# EAGLE design motor control board (EAGLE 9.6.2)
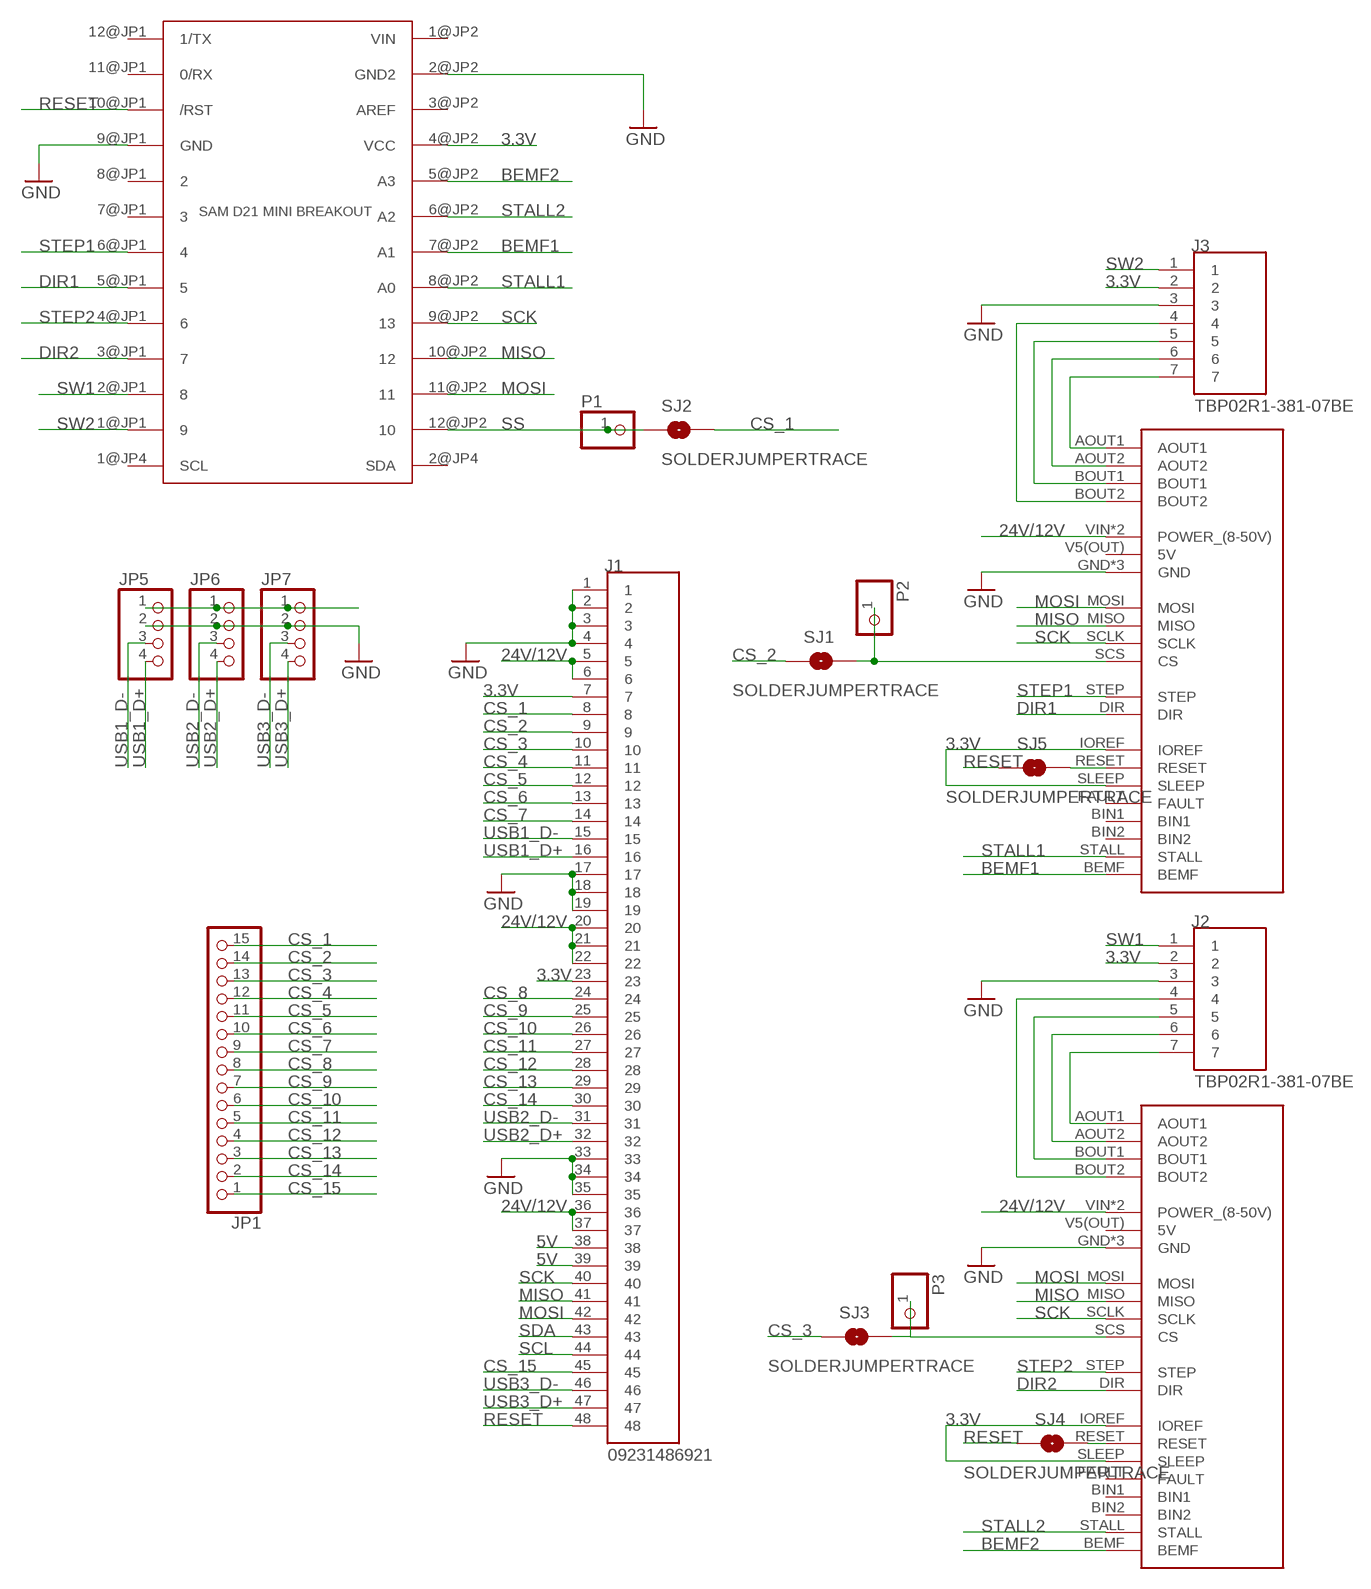
[diagram p0: schematic, sheet 1]

## Parts
J1  09231486921  [HARTING_09231486921]
J2  TBP02R1-381-07BE  [CUI_TBP02R1-381-07BE]
J3  TBP02R1-381-07BE  [CUI_TBP02R1-381-07BE]
JP1  PINHD-1X15  [1X15]
JP5  PINHD-1X4  [1X04]
JP6  PINHD-1X4  [1X04]
JP7  PINHD-1X4  [1X04]
P1  PINHD-1X1  [1X01]
P2  PINHD-1X1  [1X01]
P3  PINHD-1X1  [1X01]
SJ1  SOLDERJUMPERTRACE  [SJ_2S-TRACE]
SJ2  SOLDERJUMPERTRACE  [SJ_2S-TRACE]
SJ3  SOLDERJUMPERTRACE  [SJ_2S-TRACE]
SJ4  SOLDERJUMPERTRACE  [SJ_2S-TRACE]
SJ5  SOLDERJUMPERTRACE  [SJ_2S-TRACE]
U$1  POLOLU_HIGH-POWER_STEPPER_MOTOR_DRIVER_36V4  [BREAKOUT_BOARD]
U$2  POLOLU_HIGH-POWER_STEPPER_MOTOR_DRIVER_36V4  [BREAKOUT_BOARD]
U$4  SAM_D21_MINI_BREAKOUT  [JP1_SPARKFUN-SAMD21-MINI-BREAKOUT-V10]

## Nets
3.3V: J1.7 J1.23 J2.2 J3.2 U$1.IOREF U$1.SLEEP U$2.IOREF U$2.SLEEP U$4.4@JP2(VCC)
5V: J1.38 J1.39 JP5.1 JP6.1 JP7.1
24V/12V: J1.5 J1.6 J1.20 J1.21 J1.22 J1.36 J1.37 U$1.VIN(POWER_(8-50V)) U$1.VIN_2(POWER_(8-50V)) U$2.VIN(POWER_(8-50V)) U$2.VIN_2(POWER_(8-50V))
BEMF1: U$1.BEMF U$4.7@JP2(A1)
BEMF2: U$2.BEMF U$4.5@JP2(A3)
CS_1: J1.8 JP1.15 SJ2.2
CS_2: J1.9 JP1.14 SJ1.1
CS_3: J1.10 JP1.13 SJ3.1
CS_4: J1.11 JP1.12
CS_5: J1.12 JP1.11
CS_6: J1.13 JP1.10
CS_7: J1.14 JP1.9
CS_8: J1.24 JP1.8
CS_9: J1.25 JP1.7
CS_10: J1.26 JP1.6
CS_11: J1.27 JP1.5
CS_12: J1.28 JP1.4
CS_13: J1.29 JP1.3
CS_14: J1.30 JP1.2
CS_15: J1.45 JP1.1
DIR1: U$1.DIR U$4.5@JP1
DIR2: U$2.DIR U$4.3@JP1
GND: J1.1 J1.2 J1.3 J1.4 J1.17 J1.18 J1.19 J1.33 J1.34 J1.35 J2.3 J3.3 JP5.2 JP6.2 JP7.2 U$1.GND U$1.GND_2(GND) U$1.GND_3(GND) U$2.GND U$2.GND_2(GND) U$2.GND_3(GND) U$4.9@JP1(GND)
MISO: J1.41 U$1.MISO U$2.MISO U$4.10@JP2
MOSI: J1.42 U$1.MOSI U$2.MOSI U$4.11@JP2
N$1: J3.7 U$1.AOUT1
N$2: J3.6 U$1.AOUT2
N$3: J3.5 U$1.BOUT1
N$4: J3.4 U$1.BOUT2
N$5: SJ4.2 U$2.RESET
N$6: J2.7 U$2.AOUT1
N$7: J2.6 U$2.AOUT2
N$8: J2.5 U$2.BOUT1
N$9: J2.4 U$2.BOUT2
N$10: P2.1 SJ1.2 U$1.SCS(CS)
N$11: SJ5.2 U$1.RESET
N$12: P3.1 SJ3.2 U$2.SCS(CS)
N$13 [GND]: U$4.2@JP2(GND2) ; supply symbol labelled GND
RESET: J1.48 SJ4.1 SJ5.1 U$4.10@JP1(/RST)
SCK: J1.40 U$1.SCLK U$2.SCLK U$4.9@JP2
SCL: J1.44
SDA: J1.43
SS: P1.1 SJ2.1 U$4.12@JP2
STALL1: U$1.STALL U$4.8@JP2(A0)
STALL2: U$2.STALL U$4.6@JP2(A2)
STEP1: U$1.STEP U$4.6@JP1
STEP2: U$2.STEP U$4.4@JP1
SW1: J2.1 U$4.2@JP1
SW2: J3.1 U$4.1@JP1
USB1_D+: J1.16 JP5.4
USB1_D-: J1.15 JP5.3
USB2_D+: J1.32 JP6.4
USB2_D-: J1.31 JP6.3
USB3_D+: J1.47 JP7.4
USB3_D-: J1.46 JP7.3
Unconnected: U$1.BIN1 U$1.BIN2 U$1.FAULT U$1.V5(OUT)(5V) U$2.BIN1 U$2.BIN2 U$2.FAULT U$2.V5(OUT)(5V) U$4.1@JP4(SCL) U$4.2@JP4(SDA) U$4.7@JP1 U$4.8@JP1 U$4.11@JP1(0/RX) U$4.12@JP1(1/TX)

## Power pins joined to a net without a drawn wire
AREF: U$4.3@JP2(AREF)
VIN: U$4.1@JP2(VIN)

## Library data of the parts
J1 = din41612_48_pin_board:09231486921: Check prices <https://pricing.snapeda.com/parts/8-1393644-0/TE%20Connectivity/view-part?ref=eda>; MANUFACTURER-PART-NUMBER: 09231486921; PACKAGE: None
J2 J3 = TBP02R1-381-07BE:TBP02R1-381-07BE: Check prices <https://pricing.snapeda.com/parts/TBP02R1-381-07BE/CUI%20Devices/view-part?ref=eda>; AVAILABILITY: In Stock; CUI_PURCHASE_URL: https://www.cuidevices.com/product/interconnect/connectors/terminal-blocks/tbp02r1-381-series?utm_source=snapeda.com&utm_medium=referral&utm_campaign=snapedaBOM; DESCRIPTION: 2~24 Poles, Pluggable,Receptacle, Horizontal, 3.81 Pitch, Terminal Block Connector; MF: CUI Devices; MP: TBP02R1-381-07BE; PACKAGE: None; PRICE: None; PURCHASE-URL: https://pricing.snapeda.com/search/part/TBP02R1-381-07BE/?ref=eda
JP1 = pinhead:PINHD-1X15: PIN HEADER
JP5-JP7 = pinhead:PINHD-1X4: PIN HEADER
P1-P3 = pinhead:PINHD-1X1: PIN HEADER
SJ1-SJ5 = SparkFun-Passives:SOLDERJUMPER: Solder Jumper Standard SMD solder jumper. Used to automate production. Two varients : Normally Open and Normally Closed are the same, but have different paste layers. NC will have a large amount of paste and should jumper during reflow.
U$1 U$2 = high_power_stepper_driver_36V4:POLOLU_HIGH-POWER_STEPPER_MOTOR_DRIVER_36V4; PURCHASE_URL_POLOLU: https://www.pololu.com/product/3730/resources
U$4 = SparkFun-SAMD21-Mini-Breakout:SAM_D21_MINI_BREAKOUT: SPARKFUN-SAMD21-MINI-BREAKOUT; MANUFACTURER-PART-NUMBE: SparkFun SAMD21 mini breakout, SLW-112-01-G-S < buy two of these; PACKAGE: None; SIMILAR-COMPONENTS: None, https://www.adafruit.com/product/3008

## Net classes
1 POWER: clearance 0.508 mm
2 GND: width 0.305 mm, clearance 0.305 mm to class 0, clearance 0.305 mm to class 1

## Board
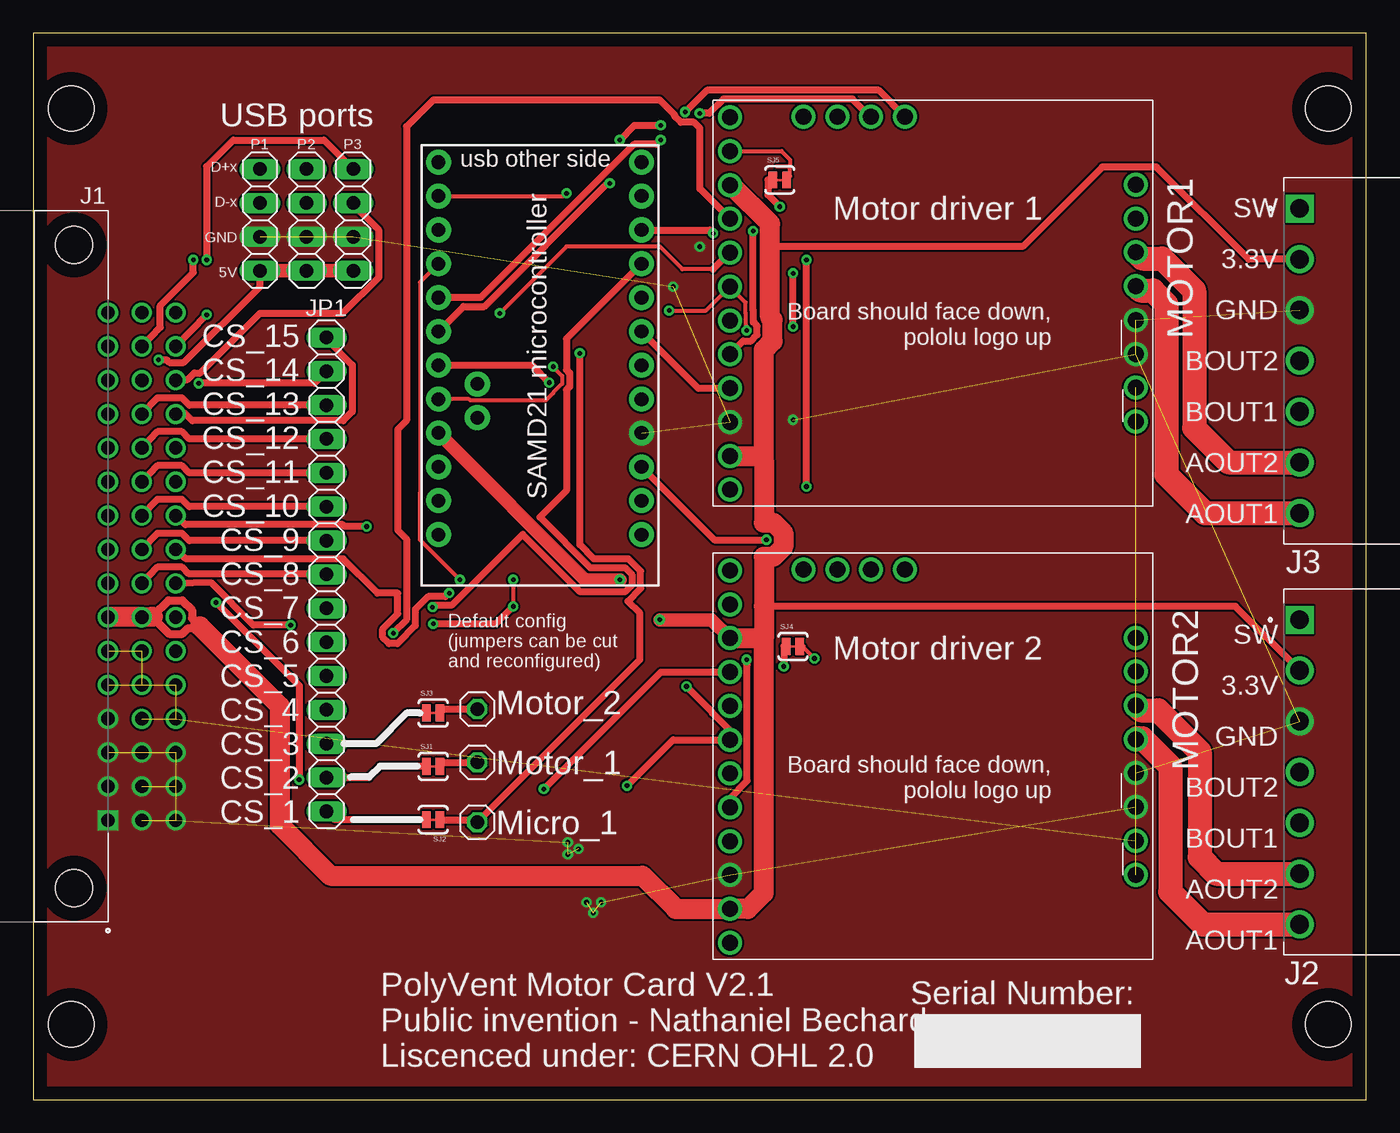
[diagram p1: board, top side]
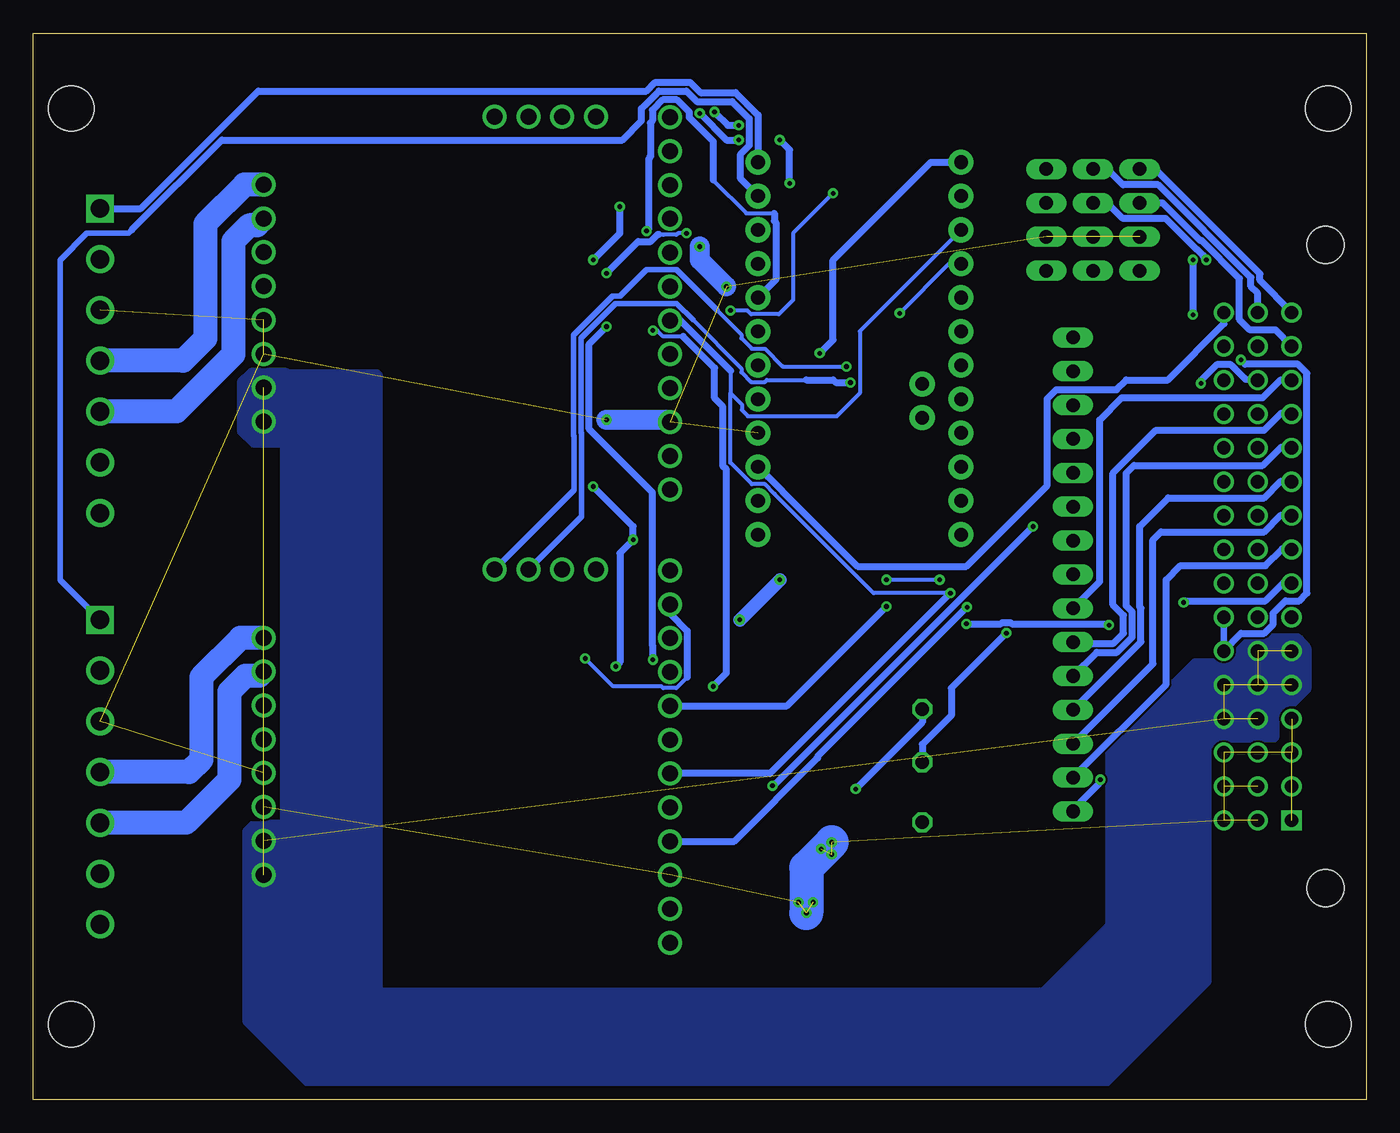
[diagram p2: board, bottom side, seen from below]

Size 100 x 80 mm. Coordinates in mm from the lower left corner, seen from the top.
Outline: 0,0 100,0 100,80 0,80 0,0
Copper layers (1*16): Top 0.035mm / dielectric 1.5mm / Bottom 0.035mm
Design rules "default": minimum track width 6mil, minimum drill 0.35mm, track to track 6mil, track to pad 6mil, pad to pad 6mil, via to via 6mil, smd to smd 6mil, copper to edge 40mil, drill to drill 6mil, minimum pad ring 10mil, minimum via ring 8mil, stop-mask expansion 4mil, vias tented up to drill 0mil, thermal gap 10mil
Holes 3.4 mm at 2.84,5.64 2.84,74.36 97.16,74.36 97.16,5.64

### Footprints (pad centres in the part's own frame; a part is rotated, then mirrored left to right if it is on the bottom)
HARTING_09231486921 = drill 1 pad 1.35 square: 1 0,0 | drill 1 pad 1.35: 2 -2.54,0; 3 -5.08,0; 4 -7.62,0; 5 -10.16,0; 6 -12.7,0; 7 -15.24,0; 8 -17.78,0; 9 -20.32,0; 10 -22.86,0; 11 -25.4,0; 12 -27.94,0; 13 -30.48,0; 14 -33.02,0; 15 -35.56,0; 16 -38.1,0; 17 0,2.54; 18 -2.54,2.54; 19 -5.08,2.54; 20 -7.62,2.54; 21 -10.16,2.54; 22 -12.7,2.54; 23 -15.24,2.54; 24 -17.78,2.54; 25 -20.32,2.54; 26 -22.86,2.54; 27 -25.4,2.54; 28 -27.94,2.54; 29 -30.48,2.54; 30 -33.02,2.54; 31 -35.56,2.54; 32 -38.1,2.54; 33 0,5.08; 34 -2.54,5.08; 35 -5.08,5.08; 36 -7.62,5.08; 37 -10.16,5.08; 38 -12.7,5.08; 39 -15.24,5.08; 40 -17.78,5.08; 41 -20.32,5.08; 42 -22.86,5.08; 43 -25.4,5.08; 44 -27.94,5.08; 45 -30.48,5.08; 46 -33.02,5.08; 47 -35.56,5.08; 48 -38.1,5.08 | hole 2.8: -43.18,-2.54; 5.08,-2.54
CUI_TBP02R1-381-07BE = drill 1.4 square: 1 0,0 | drill 1.4: 2 3.81,0; 3 7.62,0; 4 11.43,0; 5 15.24,0; 6 19.05,0; 7 22.86,0
1X15 = drill 1.016 long: 1 -17.78,0; 2 -15.24,0; 3 -12.7,0; 4 -10.16,0; 5 -7.62,0; 6 -5.08,0; 7 -2.54,0; 8 0,0; 9 2.54,0; 10 5.08,0; 11 7.62,0; 12 10.16,0; 13 12.7,0; 14 15.24,0; 15 17.78,0
1X04 = drill 1.016 long: 1 -3.81,0; 2 -1.27,0; 3 1.27,0; 4 3.81,0
1X01 = drill 1.016 octagon: 1 0,0
SJ_2S-TRACE = smd 0.635 x 1.27: 1 -0.508,0; 2 0.508,0
BREAKOUT_BOARD = drill 1.2: AOUT1 1.27,13.97; AOUT2 1.27,11.43; BEMF 18.6,1.24; BIN1 26.22,1.24; BIN2 23.68,1.24; BOUT1 1.27,8.89; BOUT2 1.27,6.35; DIR 31.75,19.08; FAULT 31.75,1.3; GND 31.75,24.16; GND_2 1.27,19.05; GND_3 1.27,16.51; IOREF 31.75,26.7; MISO 31.75,16.54; MOSI 31.75,14; RESET 31.75,3.84; SCLK 31.75,11.46; SCS 31.75,8.92; SLEEP 31.75,6.38; STALL 21.14,1.24; STEP 31.75,21.62; V5(OUT) 31.75,29.24; VIN 1.27,24.13; VIN_2 1.27,21.59
JP1_SPARKFUN-SAMD21-MINI-BREAKOUT-V10 = drill 1.016 pad 1.88: 1@JP1 1.27,1.27; 1@JP2 16.51,29.21; 1@JP4 13.589,17.907; 2@JP1 1.27,3.81; 2@JP2 16.51,26.67; 2@JP4 13.589,20.447; 3@JP1 1.27,6.35; 3@JP2 16.51,24.13; 4@JP1 1.27,8.89; 4@JP2 16.51,21.59; 5@JP1 1.27,11.43; 5@JP2 16.51,19.05; 6@JP1 1.27,13.97; 6@JP2 16.51,16.51; 7@JP1 1.27,16.51; 7@JP2 16.51,13.97; 8@JP1 1.27,19.05; 8@JP2 16.51,11.43; 9@JP1 1.27,21.59; 9@JP2 16.51,8.89; 10@JP1 1.27,24.13; 10@JP2 16.51,6.35; 11@JP1 1.27,26.67; 11@JP2 16.51,3.81; 12@JP1 1.27,29.21; 12@JP2 16.51,1.27

### Placement (x,y rotation side)
J1  5.6,20.95 270 top
J2  95,36 270 top
J3  95,66.86 270 top
JP1  22,39.4 270 top
JP5  17,66 90 top
JP6  20.5,66 90 top
JP7  24,66 90 top
P1  33.3,20.8 0 top
P2  33.3,25.3 0 top
P3  33.3,29.3 0 top
SJ1  30,25 0 top
SJ2  30,21 180 top
SJ3  30,29 0 top
SJ4  57,34 0 top
SJ5  56,69 0 top
U$1  84,75 180 top
U$2  84,41 180 top
U$4  46.9,71.6 180 top

### Tracks (layer width: path | path; a pad name or v marks a point on that pad's centre or on a via)
3.3V  (via drill 0.35)
  Top 0.508: J2.2 90.19,37 54.8,37 | 54.8,64 55.28,64 74.23,64 80.19,69.96 84.27,69.96 91.18,63.05 J3.2
  Top 0.6: 8.88,36.23 10.18,34.93 11.18,34.93 11.57,35.33 12.33,35.33 12.5,35.5 11.9,36.1 11.9,36.73 11.18,37.45 10.15,37.45 8.97,36.27 8.97,36.24
  Top 1.016: 52.36,68.62 U$1.SLEEP | U$4.4@JP2 41.4,39 v44,39 | v47,36 50.87,36 U$2.SLEEP
  Top 1.5: U$1.IOREF 54.5,48.3 54.8,48 | 54.8,34.6 54.8,37 54.8,40.72 55.53,40.72 56.28,41.47 56.28,42.53 55.53,43.28 54.8,43.28 54.8,48 | 54.8,34.6 54.8,15.5 53.6,14.3 U$2.IOREF 48.2,14.3 45.7,16.8 22.3,16.8 18.5,20.6 18.5,29.5 12.5,35.5 | U$2.SLEEP 54.78,34.62 54.8,34.6 | 54.8,48 54.8,56.24 55.46,56.9 55.46,58.51 55.28,58.69 55.28,64 55.28,65.7 52.36,68.62 | J1.7 J1.23 8.88,36.23 8.97,36.24
  Bottom 1.016: v44,39 v47,36
5V  (via drill 0.35)
  Top 0.508: v9.4,55.5 10,55.5 10.2,55.3 11.3,55.3 17,61 JP5.1
  Top 1.016: JP7.1 JP6.1 JP5.1
  Bottom 0.5: J1.39 J1.38
  Bottom 0.508: J1.38 9.4,34.98 7.66,34.98 6.98,35.66 6.98,36.5 6.06,37.42 5.02,37.42 4.44,38 4.44,54.5 5.12,55.18 9.08,55.18 v9.4,55.5
24V/12V  (10 unrouted)
  pour Bottom (no thermals): 4.6,33.8 4.6,30.9 7,28.5 7,27.3 11.3,27.3 12.1,26.5 12.1,8.9 19.9,1.1 79,1.1 83.8,5.9 83.8,20.1 83.4,20.5 81,20.5 81,49.4 83.4,49.4 84.2,50.2 84.2,53.8 83.6,54.4 81.1,54.4 81,54.3 74.3,54.3 74.3,8.2 74,7.9 24.2,7.9 19.1,13 19.1,26.3 12.8,32.6 10.4,32.6 8.5,34.5 5.2,34.5
BEMF1  (via drill 0.35)
  Top 0.508: U$1.BEMF 63.43,75.73 50.53,75.73 v48.9,74.1 | U$4.7@JP2 32.27,59.51 33.84,59.51 43.08,68.75 v43.25,68.75 | v44,72 45.1,73.1 v47.08,73.1
  Bottom 0.508: v48.9,74.1 47.9,73.1 v47.08,73.1 | v43.25,68.75 43.25,71.25 v44,72
BEMF2  (via drill 0.35)
  Top 0.305: v39,55 39,54.97 39.68,54.28 39.68,53.72 39,53.03 39,53 38.45,52.45 32.8,52.45 32.69,52.55 U$4.5@JP2
  Bottom 0.305: 48.74,59.26 46.88,57.4 46.88,57.11 46.09,56.34 45.11,56.34 43.78,55 v39,55
  Bottom 0.406: 48.72,59.25 48.74,59.26 51.73,62.26 54,62.26 55.98,60.27 56.55,60.27 59.47,57.36 59.47,49.82 59.42,49.77 59.42,45.74 U$2.BEMF
CS_1  (via drill 0.35)
  Top 0.508: JP1.15 22.62,21 SJ2.2 | v13.7,37.3 19.95,31.05 v19.95,24
  Bottom 0.508: J1.8 6.21,38.76 7.56,37.42 13.58,37.42 v13.7,37.3 | v19.95,24 20.07,23.88 20.07,23.68 22,21.75 JP1.15
CS_2
  Top 0.508: JP1.14 25.16,24.16 26,25 SJ1.1
  Bottom 0.508: JP1.14 15,31.16 15,39 13.94,40.06 7.56,40.06 6.31,41.31 J1.9
CS_3
  Top 0.508: SJ3.1 28,29 25.7,26.7 JP1.13
  Bottom 0.508: JP1.13 16,32.7 16,42 15.4,42.6 7.66,42.6 6.4,43.85 J1.10
CS_4
  Bottom 0.508: J1.11 6.4,46.4 7.66,45.14 14.86,45.14 17,43 17,36.98 16.89,36.87 16.89,34.34 JP1.12
CS_5
  Bottom 0.508: J1.12 6.4,48.94 7.76,47.58 17.42,47.58 18,47 18,37.04 17.55,36.6 17.55,34.7 18.7,33.55 20.23,33.55 JP1.11
CS_6
  Bottom 0.508: J1.13 6.4,51.48 7.66,50.22 15.78,50.22 19,47 19,37.11 18.21,36.33 18.21,34.98 18.96,34.23 21.91,34.23 JP1.10
CS_7
  Bottom 0.508: JP1.9 20,38.86 20,51 18.34,52.66 7.76,52.66 6.4,54.02 J1.14
CS_8
  Top 0.508: J1.24 9.3,39.94 11.16,39.94 11.66,39.44 21.96,39.44 JP1.8
CS_9
  Top 0.508: JP1.7 11.7,41.94 11.16,42.48 9.3,42.48 J1.25
CS_10
  Top 0.508: JP1.6 11.7,44.48 11.16,45.02 9.3,45.02 J1.26
CS_11
  Top 0.508: JP1.5 11.7,47.02 11.16,47.56 9.3,47.56 J1.27
CS_12
  Top 0.508: JP1.4 11.7,49.56 11.16,50.1 9.3,50.1 J1.28
CS_13
  Top 0.508: JP1.3 11.7,52.1 11.16,52.64 9.3,52.64 J1.29
CS_14  (via drill 0.35)
  Top 0.508: v12.4,53.74 21.1,53.74 JP1.2
  Bottom 0.508: J1.30 9.04,54.02 10.2,55.18 11.16,55.18 12.4,53.94 v12.4,53.74
CS_15
  Top 0.508: J1.45 11.39,51.48 11.94,50.93 23.25,50.93 23.93,51.62 23.93,55.12 22,57.05 JP1.1
DIR1  (via drill 0.35)
  Top 0.508: U$1.DIR 53.25,56.92 53.84,56.92 54.3,57.38 54.3,58.03 54.01,58.32 54.01,59.19 54,59.2 v54,65.17
  Bottom 0.305: 49,69 46.5,66.5 44.4,66.5
  Bottom 0.508: 53.97,65.17 v54,65.17 53.83,65.34 53.83,70.59 53.71,70.71 53.71,73.29 53.56,73.44 53.56,74.24 52.79,75.01 51.71,75.01 50.78,74.08 50.78,73.67 49,71.89 49,69 | 44.4,66.5 44.4,65.92 44.28,65.81 44.28,61.52 U$4.5@JP1
DIR2  (via drill 0.35)
  Top 0.508: U$2.DIR 52.25,22.61 53.56,23.92 53.56,32.62 53.52,32.66 v53.52,33 | v57,58 v57,62 | U$4.3@JP1 50.75,65.25 v51,65
  Bottom 0.305: v51,65 51.63,65 51.75,64.88 52.75,64.88 52.77,64.9 53.16,64.9
  Bottom 0.508: v53.52,33 53.52,34.04 53.56,34.08 53.56,45.56 58.3,50.3 58.3,56.7 v57,58 | v57,62 54.61,64.39 53.67,64.39 53.16,64.9 53.09,64.9
GND  (via drill 0.35)  (27 unrouted)
  Bottom 1.5: U$1.GND 52.41,51 v57,51 | v48,61 50,63 v50,64
  Bottom 2.54: v40.1,19.3 42,17.4 v42,14
  other vias: 40.9,18.8 40.1,18.4 41.5,14.8 42.6,14.8
  pour Top (no thermals): 0,0 0,80 100,80 100,0
MISO  (via drill 0.35)
  Top 0.508: J1.41 11.4,40.6 11.43,40.6 11.47,40.57 23.25,40.57 25.81,38 27.34,38 27.34,36.45 26.21,35.33 26.21,34.67 26.68,34.22 27.32,34.22 28.66,35.55 28.66,36.77 29.62,37.73 30.93,37.73 v31.2,38
  Bottom 0.305: 47.7,54.7 47.7,53 | U$4.10@JP2 38,57.64 38,53 39.72,51.28 46.38,51.28 46.85,51.74 46.85,52.15 47.7,53 | v31.2,38 36.95,38 44.38,45.44 44.38,45.45 45.11,46.17 46.09,46.17 47.7,47.78 47.7,53
  Bottom 0.508: 31.41,37.78 v31.2,38 44.74,24.46 U$2.MISO | U$1.MISO 51.46,58.46 47.7,54.7 47.67,54.67
MOSI  (via drill 0.35)
  Top 0.305: v53.52,57.71 53.52,58.03 53.45,58.09 53.45,58.96 53.44,58.97 53.44,59.81 U$1.MOSI 50.45,59.2 v47.7,59.2 | U$4.11@JP2 39.79,67.79 v40,68
  Top 0.508: v25,43 23.35,43 23.21,43.14 11.4,43.14 J1.42 | v44.55,23.55 48,27 U$2.MOSI 52.25,27.69 50.94,29 50.94,29.06 v49,31
  Bottom 0.305: v53.52,57.71 53.2,57.71 52.75,57.26 51.26,57.26 | v40,68 43,65 43,60 44.08,58.92 46.15,58.92 46.42,59.2 v47.7,59.2
  Bottom 0.508: 51.26,57.26 48.88,54.88 48.88,52.62 48.26,51.99 48.26,47.55 48,47.29 48,32 v49,31 | v44.55,23.55 44.45,23.55 v25,43
N$1
  Top 1.8: U$1.AOUT1 83.06,60.7 84,60.7 85,59.7 85,46.9 87.9,44 J3.7
N$2
  Top 1.8: U$1.AOUT2 83.2,63.1 84.7,63.1 87.1,60.7 87.1,50.4 89.69,47.81 J3.6
N$3
  Bottom 1.8: U$1.BOUT1 83.24,65.6 83.8,65.6 85,64.4 85,55.9 89.28,51.62 J3.5
N$4
  Bottom 1.8: U$1.BOUT2 84.15,68.65 87.1,65.7 87.1,57.1 88.77,55.43 J3.4
N$5  (via drill 0.35)
  Top 0.152: SJ4.2 57.7,34 57.79,33.91
  Top 0.305: v58.6,33.1 57.79,33.91 57.79,34
  Bottom 0.305: 50.94,31.68 51.75,30.88 52.75,30.88 52.87,31 56.5,31 v58.6,33.1
  Bottom 0.508: U$2.RESET 52.25,36.47 50.94,35.16 50.94,31.68
N$6
  Top 1.8: U$2.AOUT1 82.8,27.1 83.2,27.1 85.3,25 85.3,15.6 87.76,13.14 J2.7
N$7
  Top 1.8: U$2.AOUT2 83.1,29.2 84.4,29.2 87.5,26.1 87.5,18.2 88.75,16.95 J2.6
N$8
  Bottom 1.8: U$2.BOUT1 83.04,31.8 84.1,31.8 85.3,30.6 85.3,24 88.54,20.76 J2.5
N$9
  Bottom 1.8: U$2.BOUT2 84.45,34.65 87.4,31.7 87.4,25.5 88.33,24.57 J2.4
N$10  (via drill 0.35)
  Top 0.508: SJ1.2 30.81,25.3 P2.1 | U$1.SCS 50,68.33 50,72.89 49.58,73.31 48.58,73.31 48.12,73.78 48.12,73.89 47,75 30,75 28,73 28,50.93 27.34,50.27 27.34,42.73 28,42.07 28,36 v27,35
  Bottom 0.508: v27,35 31.13,30.87 31.13,28.82 33.3,26.65 P2.1
N$11
  Top 0.305: U$1.RESET 56.14,71.16 56.79,70.51 56.79,70 | 56.79,70 55.79,70 | SJ5.2 56.79,69.28 56.79,70
N$12  (via drill 0.35)
  Top 0.508: SJ3.2 30.81,29.3 P3.1 | U$2.SCS 47.08,32.08 v38.3,23.3
  Bottom 0.508: P3.1 33.3,28.3 v38.3,23.3
RESET  (via drill 0.35)
  Top 0.508: U$4.10@JP1 51.1,42 v55,42 | v56.3,32.5 56.3,34 SJ4.1 | v58,46 v58,63 | v56,67 55.11,67.89 55.11,69 SJ5.1
  Bottom 0.508: J1.48 10.68,58.2 14.88,54 18,54 18.73,53.27 23.25,53.27 23.93,52.58 23.93,46.07 30,40 38.16,40 43.83,45.67 43.83,45.68 44.88,46.73 44.89,46.73 U$4.10@JP1 | v56.3,32.5 56,32.8 56,41 v55,42 55,43 v58,46 | v58,63 56,65 v56,67
SCK  (via drill 0.35)
  Top 0.305: U$4.9@JP2 29,61.32 29,45.52 28.99,45.51 28.99,42.01 v32,39 | v36,39 v36,37 | 51.01,62.3 48.7,62.3 47,64 40,64 v35,59
  Top 0.508: v19.3,35.6 16.51,35.6 13.33,38.78 J1.40 | v36,37 34.69,35.69 v30,35.69 | U$1.SCLK 51.01,62.3
  Bottom 0.305: v32,39 v36,39 | v35,59 31.29,62.71 U$4.9@JP2
  Bottom 0.508: v19.3,35.6 19.39,35.69 26.58,35.69 26.68,35.78 27.32,35.78 27.42,35.69 v30,35.69 | U$2.SCLK 43.46,29.54 v36,37
SS  (via drill 0.35)
  Top 0.508: SJ2.1 33.1,21 P1.1 45.51,33.01 45.51,36.49 44.61,37.39 45.58,38.35 45.58,39.65 44.65,40.58 42.05,40.58 41,41.63 v41,56
  Bottom 0.508: v41,56 40,57 40,63 32.67,70.33 U$4.12@JP2
STALL1  (via drill 0.35)
  Top 0.508: U$1.STALL 62.77,73.76 61.46,75.07 51.77,75.07 50.7,74 v50,74 | v47.08,72 46.75,71.68 45.07,71.68 33.57,60.17 U$4.8@JP2
  Bottom 0.508: v50,74 48,72 v47.08,72
STALL2  (via drill 0.35)
  Top 0.508: U$4.6@JP2 37.41,55.09 v38.7,53.8
  Bottom 0.305: 50.52,58.51 46.88,54.86 46.88,54.57 46.15,53.84 45.11,53.84 44.96,54 40,54
  Bottom 0.406: 50.52,58.51 51.73,59.72 56.32,59.72 58.91,57.13 58.91,50.05 58.86,50 58.86,43.76 U$2.STALL
  Bottom 0.508: 42,54 40,54 39.8,53.8 v38.7,53.8
STEP1
  Top 0.508: U$4.6@JP1 49.88,53.38 U$1.STEP
STEP2  (via drill 0.35)
  Top 0.508: 30,37 v29.95,36.95 30.07,37.07 31.38,37.07 36.71,42.4 41.02,38.09 44.38,38.09 44.91,38.62 44.91,39.38 44.38,39.91 41.78,39.91 38,43.69 40,45.69 40,53.24 40.24,53.49 40.24,54.51 40,54.76 40,57.08 U$4.4@JP1
  Bottom 0.508: v29.95,36.95 41.16,25.73 41.16,25.62 47.4,19.38 U$2.STEP
SW1
  Bottom 0.406: 92.61,65.25 92.86,65 96,65 98,63 98,39 J2.1
  Bottom 0.508: 92.61,65.25 85.86,72 55.8,72 54.37,73.43 54.37,74.36 53.06,75.67 51,75.67 50.22,74.89 47.58,74.89 46.29,73.6 46.29,71.57 46.98,70.89 46.98,69.14 U$4.2@JP1
SW2
  Bottom 0.508: J3.1 91.93,66.86 83.13,75.67 54,75.67 53.34,76.33 50.73,76.33 49.94,75.55 47.3,75.55 45.63,73.87 U$4.1@JP1
USB1_D+
  Bottom 0.508: J1.16 7.98,61.48 7.98,61.96 15.83,69.81 JP5.4
USB1_D-
  Bottom 0.508: J1.15 6.79,57.74 8.72,57.74 9.5,58.52 9.5,61.61 12.34,64.44 12.45,64.44 15.27,67.27 JP5.3
USB2_D+
  Bottom 0.508: JP6.4 19.41,69.81 18.25,68.64 15.6,68.64 8.64,61.68 8.64,61.01 8.14,60.51 J1.32
USB2_D-  (via drill 0.35)
  Top 0.508: J1.31 9.52,57.94 9.52,59.58 12,62.06 v12,63
  Bottom 0.508: JP6.3 19.41,67.27 18.25,66.1 15.04,66.1 12.72,63.78 12.68,63.78 12.21,63.33 12.21,63.22 v12,63
USB3_D+  (via drill 0.35)
  Top 0.508: J1.47 v13,58.88 | JP7.4 21.81,72 15,72 13,70 v13,63
  Bottom 0.508: v13,63 v13,58.88
USB3_D-
  Top 0.508: J1.46 11.57,54.02 12.07,54.52 12.53,54.52 17,59 23.22,59 25.93,61.71 25.93,65.21 24,67.14 JP7.3

### Text on the board
tNames: USB ports | P1 P2 P3 | D+x / D-x / GND / 5V | SAMD21 microcontroller | SW / 3.3V / GND / BOUT2 / BOUT1 / AOUT2 / AOUT1 | Motor driver 1 | MOTOR1 | SW / 3.3V / GND / BOUT2 / BOUT1 / AOUT2 / AOUT1 | Motor driver 2 | Default config / (jumpers can be cut / and reconfigured) | MOTOR2 | CS_15 / CS_14 / CS_13 / CS_12 / CS_11 / CS_10 / CS_9 / CS_8 / CS_7 / CS_6 / CS_5 / CS_4 / CS_3 / CS_2 / CS_1 | Motor_2 / Motor_1 / Micro_1 | Serial Number: | PolyVent Motor Card V2.1 / Public invention - Nathaniel Bechard / Liscenced under: CERN OHL 2.0